# Altium schematic sheet Sch_sheet1.SchDoc
size B; SheetNumber: 1; SheetTotal: 1
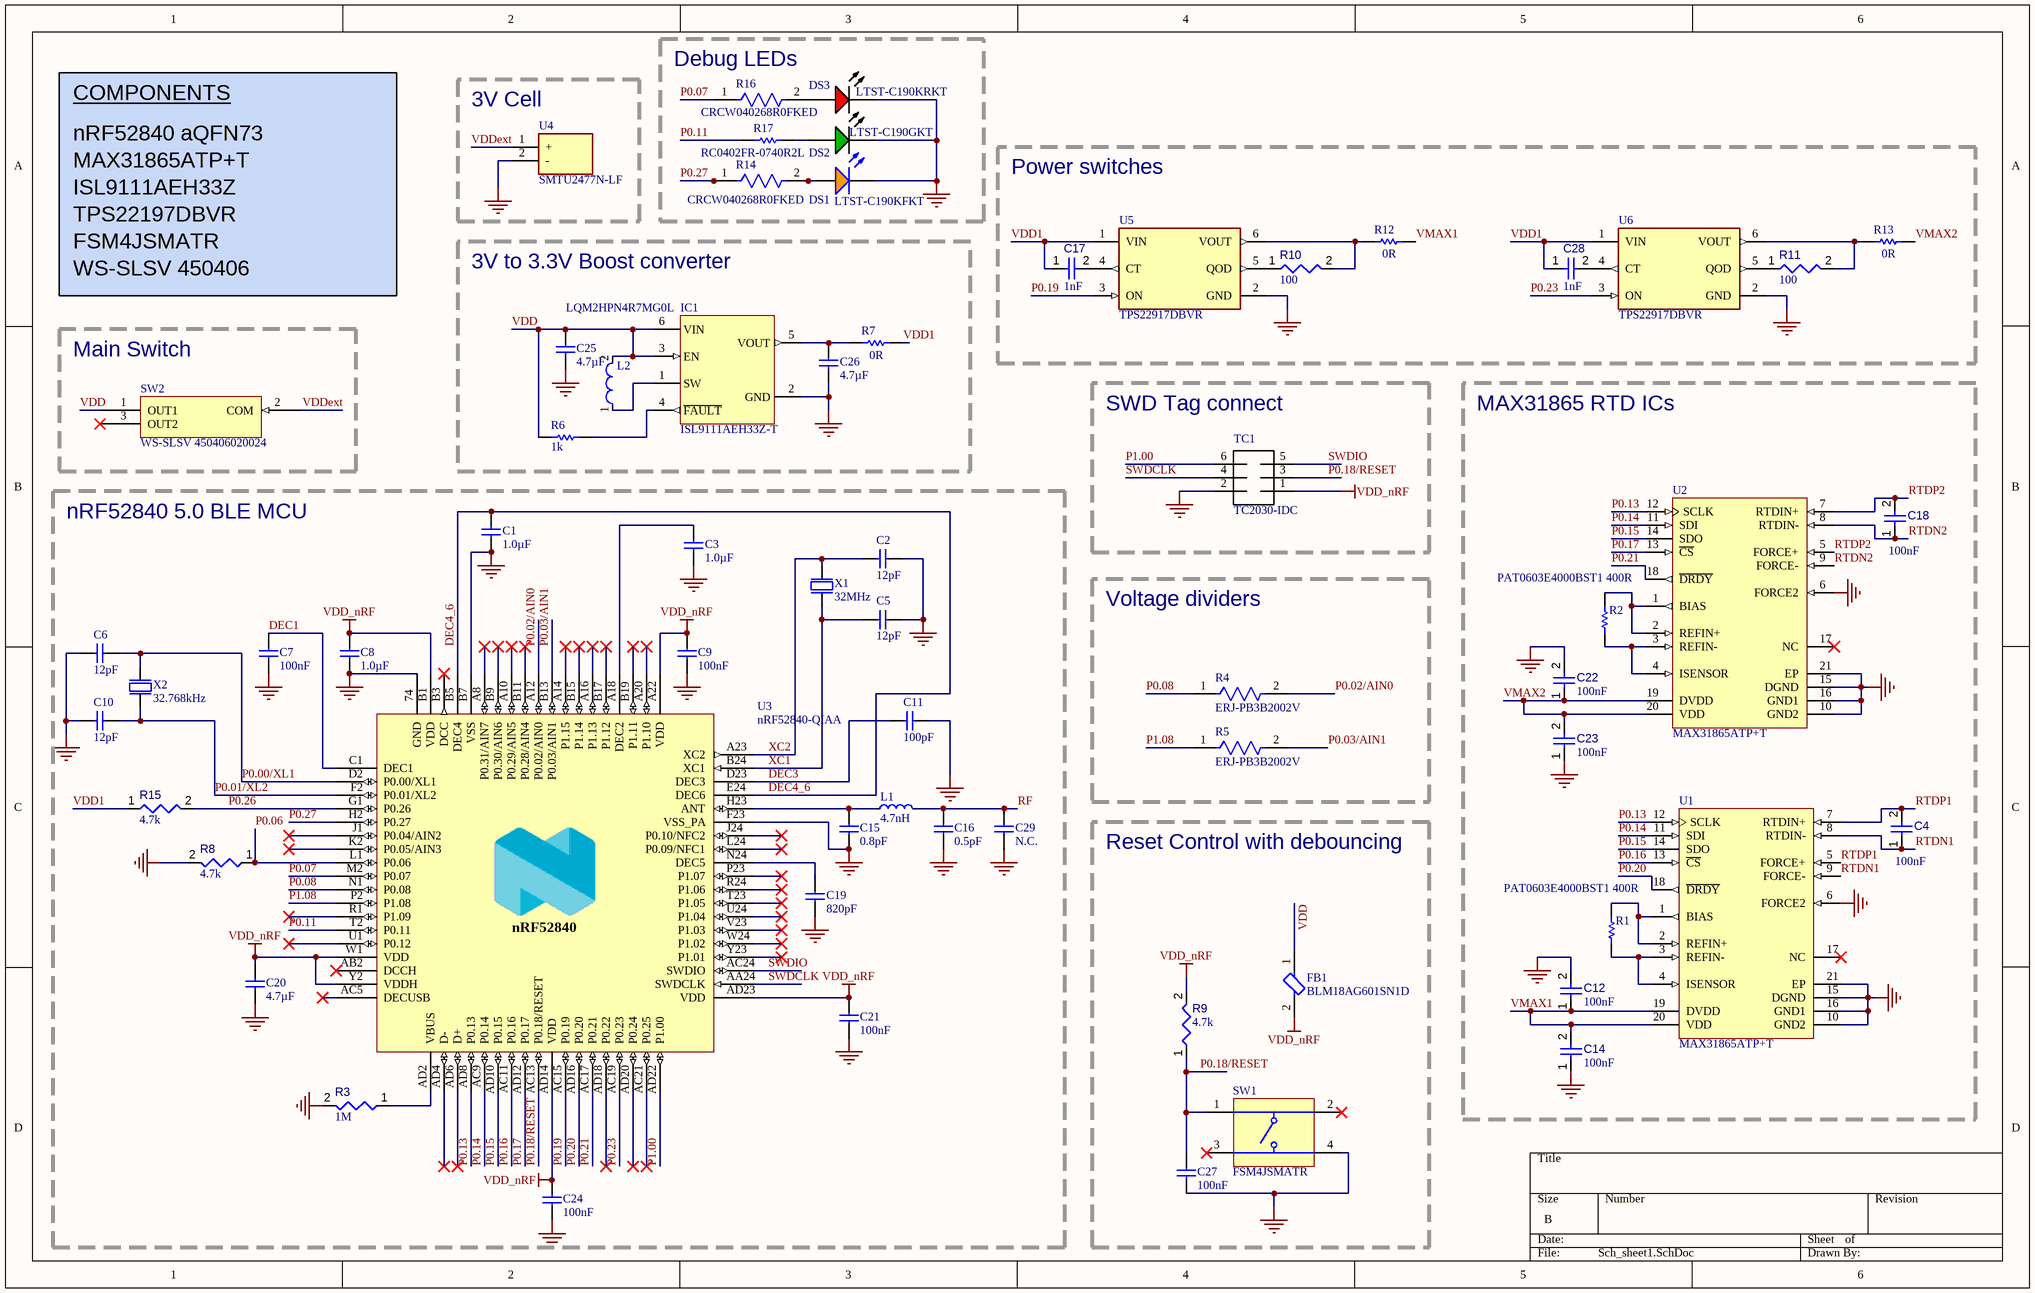
[diagram p0: Sch_sheet1.SchDoc]

## Parts
C1  1.0µF  [CAPC1608X06L]
C2  12pF  [CAPC1005X04L]
C3  1.0µF  [CAPC1608X06L]
C4  value 100nF  [CAPC0402(1005)60_L]  (hidden comment: Capacitor 100nF +/-20% 25V 0402)
C5  12pF  [CAPC1005X04L]
C6  12pF  [CAPC1005X04L]
C7  100nF  [CAPC1005X04L]
C8  1.0µF  [CAPC1608X06L]
C9  100nF  [CAPC1005X04L]
C10  12pF  [CAPC1005X04L]
C11  100pF  [CAPC1005X04L]
C12  value 100nF  [CAPC0402(1005)60_L]  (hidden comment: Capacitor 100nF +/-20% 25V 0402)
C14  value 100nF  [CAPC0402(1005)60_L]  (hidden comment: Capacitor 100nF +/-20% 25V 0402)
C15  0.8pF  [CAPC1005X04L]
C16  0.5pF  [CAPC1005X04L]
C17  value 1nF  [CAPC0402(1005)33_L]  (hidden comment: Capacitor 1nF +/-20% 50V 0402)
C18  value 100nF  [CAPC0402(1005)60_L]  (hidden comment: Capacitor 100nF +/-20% 25V 0402)
C19  820pF  [CAPC1005X04L]
C20  4.7µF  [CAPC1608X06L]
C21  100nF  [CAPC1005X04L]
C22  value 100nF  [CAPC0402(1005)60_L]  (hidden comment: Capacitor 100nF +/-20% 25V 0402)
C23  value 100nF  [CAPC0402(1005)60_L]  (hidden comment: Capacitor 100nF +/-20% 25V 0402)
C24  100nF  [CAPC1005X04L]
C25  4.7µF  [CAPC1608X06L]
C26  4.7µF  [CAPC1608X06L]
C27  100nF  [CAPC1005X04L]
C28  value 1nF  [CAPC0402(1005)33_L]  (hidden comment: Capacitor 1nF +/-20% 50V 0402)
C29  N.C.  [CAPC1005X04L]
DS1  LTST-C190KFKT  [LTST-C190KFKT_V]
DS2  LTST-C190GKT  [LTST-C190GKT_V]
DS3  LTST-C190KRKT  [LTST-C191KRKT_V]
FB1  BLM18AG601SN1D  [FP-BLM18-0_15-t0_8-MFG]
IC1  ISL9111AEH33Z-T  [SOT95P280X145-6N]
L1  4.7nH  [INDC1005X04L]
L2  LQM2HPN4R7MG0L  [FP-LQM2HPN_G0-IPC_A]
R1  PAT0603E4000BST1 400R  [RESC1608X46X38LL15T13]
R2  PAT0603E4000BST1 400R  [RESC1608X46X38LL15T13]
R3  value 1M  [RESC0402(1005)_L]  (hidden comment: Resistor 1M +/-5 % 0402 63 mW)
R4  ERJ-PB3B2002V  [FP-ERJPB3-MFG]
R5  ERJ-PB3B2002V  [FP-ERJPB3-MFG]
R6  value 1k  [RESC3116X70X50ML13T20]  (hidden comment: Resistor 1k +/-1% 1206 250 mW)
R7  0R  [RESC1608X06N]
R8  value 4.7k  [RESC3116X70X50ML13T20]  (hidden comment: Resistor 4k7 +/-1% 1206 250 mW)
R9  value 4.7k  [RESC3116X70X50ML13T20]  (hidden comment: Resistor 4k7 +/-1% 1206 250 mW)
R10  value 100  [RESC0402(1005)_L]  (hidden comment: Resistor 100R +/-1 % 0402 63 mW)
R11  value 100  [RESC0402(1005)_L]  (hidden comment: Resistor 100R +/-1 % 0402 63 mW)
R12  0R  [RESC1608X06N]
R13  0R  [RESC1608X06N]
R14  CRCW040268R0FKED  [FP-CRCW0402-e3-MFG]
R15  value 4.7k  [RESC3116X70X50ML13T20]  (hidden comment: Resistor 4k7 +/-1% 1206 250 mW)
R16  CRCW040268R0FKED  [FP-CRCW0402-e3-MFG]
R17  RC0402FR-0740R2L  [RESC1005X40X25ML05T10]
SW1  FSM4JSMATR  [TECO-FSM4JSMATR_V]
SW2  WS-SLSV 450406020024  [WS-SLSV 450406020024]
TC1  TC2030-IDC  [*TC2030-IDC]
U1  MAX31865ATP+T  [MAXM-T2055+5_L]
U2  MAX31865ATP+T  [MAXM-T2055+5_L]
U3  nRF52840-QIAA  [AQFN50P700X700X85_HS-74N]
U4  SMTU2477N-LF  [SMTU2477NLF]
U5  TPS22917DBVR  [FP-DBV0006A-IPC_A]
U6  TPS22917DBVR  [FP-DBV0006A-IPC_A]
X1  32MHz  [BT-XTAL_2016]
X2  32.768kHz  [XTAL_3215]

## Blocks framed on the sheet
Debug LEDs: DS1-DS3 R14 R16 R17
3V Cell: U4
Power switches: C17 C28 R10-R13 U5 U6
3V to 3.3V Boost converter: C25 C26 IC1 L2 R6 R7
Main Switch: SW2
SWD Tag connect: TC1
MAX31865 RTD ICs: C4 C12 C14 C18 C22 C23 R1 R2 U1 U2
nRF52840 5.0 BLE MCU: C1-C3 C5-C11 C15 C16 C19-C21 C24 C29 L1 R3 R8 R15 U3 X1 X2
Voltage dividers: R4 R5
Reset Control with debouncing: C27 FB1 R9 SW1

## Nets
GND: C1.1 C2.2 C3.1 C5.2 C6.1 C7.1 C8.1 C9.1 C10.1 C11.2 C12.2 C14.1 C15.1 C16.1 C19.1 C20.1 C21.1 C22.2 C23.1 C24.1 C25.1 C26.1 C27.1 C29.1 DS1.2(K) DS2.2(K) DS3.2(K) IC1.2(GND) R3.2 R8.2 SW1.4 TC1.2(GND) U1.6(FORCE2) U1.10(GND2) U1.15(DGND) U1.16(GND1) U1.21(EP) U2.6(FORCE2) U2.10(GND2) U2.15(DGND) U2.16(GND1) U2.21(EP) U3.74(GND) U3.B7(VSS) U3.F23(VSS_PA) U4.2(-) U5.2(GND) U6.2(GND) X1.2(GND) X1.4(GND)
VDD_nRF: C8.2 C9.2 C20.2 C21.2 C24.2 FB1.2 R9.2 TC1.1(VCC) U3.A22(VDD) U3.AD14(VDD) U3.AD23(VDD) U3.B1(VDD) U3.W1(VDD) U3.Y2(VDDH)
DEC1: C7.2 U3.C1(DEC1)
DEC3: C11.1 U3.D23(DEC3)
DEC4_6: C1.2 U3.B5(DEC4) U3.E24(DEC6)
P0.00/XL1: C6.2 U3.D2(P0.00/XL1) X2.2(out)
P0.01/XL2: C10.2 U3.F2(P0.01/XL2) X2.1(inp)
P0.02/AIN0: R4.2 U3.A12(P0.02/AIN0)
P0.03/AIN1: R5.2 U3.B13(P0.03/AIN1)
P0.06: R8.1 U3.L1(P0.06)
P0.07: R16.1 U3.M2(P0.07)
P0.08: R4.1 U3.N1(P0.08)
P0.11: R17.1 U3.T2(P0.11)
P0.13: U1.12(SCLK) U2.12(SCLK) U3.AD8(P0.13)
P0.14: U1.11(SDI) U2.11(SDI) U3.AC9(P0.14)
P0.15: U1.14(SDO) U2.14(SDO) U3.AD10(P0.15)
P0.16: U1.13(~{CS}) U3.AC11(P0.16)
P0.17: U2.13(~{CS}) U3.AD12(P0.17)
P0.18/RESET: C27.2 R9.1 SW1.1 TC1.3(RST) U3.AC13(P0.18/RESET)
P0.19: U3.AC15(P0.19) U5.3(ON)
P0.20: U1.18(~{DRDY}) U3.AD16(P0.20)
P0.21: U2.18(~{DRDY}) U3.AC17(P0.21)
P0.23: U3.AC19(P0.23) U6.3(ON)
P0.26: R15.2 U3.G1(P0.26)
P0.27: R14.1 U3.H2(P0.27)
P1.00: TC1.6(SWO) U3.AD22(P1.00)
P1.08: R5.1 U3.P2(P1.08)
RF: C16.2 C29.2 L1.2
RTDN1: C4.1 U1.8(RTDIN-) U1.9(FORCE-)
RTDN2: C18.1 U2.8(RTDIN-) U2.9(FORCE-)
RTDP1: C4.2 U1.5(FORCE+) U1.7(RTDIN+)
RTDP2: C18.2 U2.5(FORCE+) U2.7(RTDIN+)
SWDCLK: TC1.4(SWCLK) U3.AA24(SWDCLK)
SWDIO: TC1.5(SWDIO) U3.AC24(SWDIO)
VDD: C25.2 FB1.1 IC1.3(EN) IC1.6(VIN) L2.2 R6.1 SW2.1(OUT1)
VDD1: C17.1 C28.1 R7.2 R15.1 U5.1(VIN) U6.1(VIN)
VDDext: SW2.2(COM) U4.1(+)
VMAX1: C12.1 C14.2 R12.2 U1.19(DVDD) U1.20(VDD)
VMAX2: C22.1 C23.2 R13.2 U2.19(DVDD) U2.20(VDD)
XC1: C5.1 U3.B24(XC1) X1.1(inp)
XC2: C2.1 U3.A23(XC2) X1.3(out)
NetC3_2: C3.2 U3.A18(DEC2)
NetC15_2: C15.2 L1.1 U3.H23(ANT)
NetC17_2: C17.2 U5.4(CT)
NetC19_2: C19.2 U3.N24(DEC5)
NetC26_2: C26.2 IC1.5(VOUT) R7.1
NetC28_2: C28.2 U6.4(CT)
NetDS1_1: DS1.1(A) R14.2
NetDS2_1: DS2.1(A) R17.2
NetDS3_1: DS3.1(A) R16.2
NetIC1_1: IC1.1(SW) L2.1
NetIC1_4: IC1.4(~{FAULT}) R6.2
NetR1_1: R1.1 U1.1(BIAS) U1.2(REFIN+)
NetR1_2: R1.2 U1.3(REFIN-) U1.4(ISENSOR)
NetR2_1: R2.1 U2.1(BIAS) U2.2(REFIN+)
NetR2_2: R2.2 U2.3(REFIN-) U2.4(ISENSOR)
NetR3_1: R3.1 U3.AD2(VBUS)
NetR10_1: R10.1 U5.5(QOD)
NetR10_2: R10.2 R12.1 U5.6(VOUT)
NetR11_1: R11.1 U6.5(QOD)
NetR11_2: R11.2 R13.1 U6.6(VOUT)

Not connected (* = marked no-connect by the designer): SW1 2* 3*; SW2 3(OUT2)*; U1 17(NC)*; U2 17(NC)*; U3 A8(P0.31/AIN7)* A10(P0.29/AIN5)* A14(P1.15)* A16(P1.13)* A20(P1.10)* AB2(DCCH)* AC5(DECUSB)* AC21(P0.25)* AD4(D-)* AD6(D+)* AD18(P0.22)* AD20(P0.24)* B3(DCC)* B9(P0.30/AIN6)* B11(P0.28/AIN4)* B15(P1.14)* B17(P1.12)* B19(P1.11)* J1(P0.04/AIN2)* J24(P0.10/NFC2)* K2(P0.05/AIN3)* L24(P0.09/NFC1)* P23(P1.07)* R1(P1.09)* R24(P1.06)* T23(P1.05)* U1(P0.12)* U24(P1.04)* V23(P1.03)* W24(P1.02)* Y23(P1.01)*

## Notes on the sheet
- COMPONENTS
- nRF52840 aQFN73
- MAX31865ATP+T
- ISL9111AEH33Z
- TPS22197DBVR
- FSM4JSMATR
- WS-SLSV 450406
- (in symbol nRF52840-QIAA) nRF52840

## Library data of the parts
C1 C3 C8 = C0603-1µ0: Capacitor, X7R, ±10%; Pad Count: 2; Part Number: C0603-1µ0; LatestRevisionDate: 2013-06-05; Published: 2009-05-08; Value: 1.0µF; Footprint Doc: 0603
C2 C5 C6 C10 = C0402-12p: Capacitor, NP0, ±2%; Pad Count: 2; Part Number: C0402-12p; LatestRevisionDate: 2011-05-11; Published: 2009-05-08; Value: 12pF; Footprint Doc: 0402
C4 C12 C14 C18 C22 C23 = CMP-001-00065-4: Chip Capacitor, 100nF +/-20%, 25V, 0402, Thickness 0.6 mm; Tolerance: 10%; Max Operating Temperature: 85°C; Min Operating Temperature: -55°C; Pins: 2; Voltage Rating: 25V; Mounting Technology: SMT; Case/Package: 0402
C7 C9 C21 C24 C27 = C0402-100n: Capacitor, X7R, ±10%; Pad Count: 2; Part Number: C0402-100n; LatestRevisionDate: 2009-11-23; Published: 2009-05-08; Value: 100nF; Footprint Doc: 0402
C11 = C0402-100p: Capacitor, NP0, ±5%; Pad Count: 2; Part Number: C0402-100p; LatestRevisionDate: 2009-05-08; Published: 2009-05-08; Value: 100pF; Footprint Doc: 0402
C15 = C0402-0.8p: Capacitor, NP0, ±10%; Pad Count: 2; Part Number: C0402-0.8p; LatestRevisionDate: 2012-11-21; Published: 2009-05-08; Value: 0.8pF; Footprint Doc: 0402
C16 = C0402-0.5p: Capacitor, NP0, ±10%; Pad Count: 2; Part Number: C0402-0.5p; LatestRevisionDate: 2017-02-23; Published: 2009-05-08; Value: 0.5pF; Footprint Doc: 0402
C17 C28 = CMP-001-00066-3: Chip Capacitor, 1nF +/-20%, 50V, 0402, Thickness 0.33 mm; Tolerance: 10%; Case/Package: 0402; Pins: 2; Min Operating Temperature: -55°C; Max Operating Temperature: 85°C; Voltage Rating: 50V; Mounting Technology: SMT
C19 = C0402-820p: Capacitor, NP0, ±5%; Pad Count: 2; Part Number: C0402-820p; LatestRevisionDate: 2009-05-08; Published: 2009-05-08; Value: 820pF; Footprint Doc: 0402
C20 C25 C26 = C0603-4µ7-6.3V-X7R: Capacitor, X7R, ±10%; Pad Count: 2; Part Number: C0603-4µ7-6.3V-X7R; LatestRevisionDate: 2015-06-10; Published: 2015-06-10; Value: 4.7µF; Footprint Doc: 0603
C29 = C0402-N.C.: Not mounted; Pad Count: 2; Assembly: Not mounted; Part Number: C0402-N.C.; LatestRevisionDate: 2009-05-08; Published: 2009-05-08; Value: N.C.; Footprint Doc: 0402
DS1 = CMP-007-00023-2: LED Uni-Color Orange, 75 mW, 30 mA, -35 to 85 degC, 2-Pin SMD, RoHS, Tape and Reel; Manufacturer: Lite-On; Power: 75mW; Luminous Intensity: 90mcd; Nominal Vf: 2V; Lens Style: Diffused; Forward Current: 20mA; Viewing Angle: 130degrees; Max Operating Temperature: 85°C; Manufacturer URL: http://www.us.liteon.com/; Package Description: 2-Pin Surface Mount Device, Body 1.6 x 0.8 mm; Package Quantity: 3000; Pins: 2; Min Operating Temperature: -55°C; Mounting Technology: SM; Colour: Orange; Packaging: TapeandReel; Case/Package: 0603; Datasheet Version: Rev. I, 09/2011; Illumination Colour: Orange; Datasheet URL: http://optoelectronics.liteon.com/upload/download/DS-22-99-0186/S_110_LTST-C190KFKT.pdf; Package Reference: C190KFKT; RoHS Compliant: True; Forward Voltage: 2V
DS2 = CMP-007-00022-2: LED Uni-Color Green, 100 mW, 30 mA, -55 to 85 degC, 2-Pin SMD, RoHS, Tape and Reel; Manufacturer: Lite-On; Power: 100mW; Forward Voltage: 2.1V; Viewing Angle: 130degrees; Forward Current: 20mA; Luminous Intensity: 6mcd; Lens Style: Clear; Manufacturer URL: http://www.us.liteon.com/; RoHS Compliant: True; Colour: Green; Package Description: 2-Pin Surface Mount Device, Body 1.6 x 0.8 mm; Datasheet URL: http://datasheet.octopart.com/LTST-C190GKT-Lite-On-datasheet-158530.pdf; Datasheet Version: Dec-06; Mounting Technology: SM; Case/Package: 0603; Package Reference: C190GKT; Packaging: TapeandReel; Min Operating Temperature: -55°C; Nominal Vf: 2.1V; Package Quantity: 3000; Illumination Colour: Green; Max Operating Temperature: 85°C; Pins: 2
DS3 = CMP-007-00024-2: LED Uni-Color Red, 62.5 mW, 25 mA, -30 to 85 degC, 2-Pin SMD, RoHS, Tape and Reel; Manufacturer: Lite-On; Power: 75mW; Forward Voltage: 2V; Luminous Intensity: 54mcd; Lens Style: Diffused; Viewing Angle: 130degrees; Forward Current: 20mA; Manufacturer URL: http://www.us.liteon.com/; Case/Package: 0603; Datasheet Version: Rev. F, 05/2013; Package Reference: C191KRKT; Datasheet URL: http://optoelectronics.liteon.com/upload/download/DS-22-99-0151/S_110_LTST-C190KRKT.pdf; Package Description: 2-Pin Surface Mount Device, Body 1.6 x 0.8 mm; Nominal Vf: 2V; Packaging: TapeandReel; RoHS Compliant: True; Pins: 2; Illumination Colour: Red; Colour: Red; Mounting Technology: SM; Package Quantity: 3000; Min Operating Temperature: -55°C; Max Operating Temperature: 85°C
FB1 = CMP-0686-00436-3: Chip Ferrite Bead, 0603, 600Ω @ 100MHz, 0.38Ω, 25%, 500mA; Number of Lines: 1; Impedance: 600R; DC Resistance (DCR): 380mR; Material: Steel; Shielding: Unshielded; Max DC Current: 500mA; Termination: SMD/SMT; Military Standard: Not; Number of Circuits: 1; Min Operating Temperature: -55°C; Case Code (Imperial): 0603; Width: 0.8mm; Current Rating: 500mA; Lead Free: Lead Free; Packaging: Tape and Reel; Frequency: 100MHz; Max Operating Temperature: 125°C; DC Current: 500mA; REACH SVHC: No SVHC; Case/Package: 0603; Package Quantity: 1; Height: 0.8mm; Number of Pins: 2; Depth: 0.8mm; Test Frequency: 100MHz; Case Code (Metric): 1608; Tolerance: 25%; Core Material: Ferrite; Weight: 7.1E-05oz; Max Current Rating: 500mA; Radiation Hardening: No; Length: 1.6mm; RoHS Compliant: Yes
IC1 = CMP-00572-88256068-1: ISL9111AEH33Z-T Low Input Voltage, High Efficiency Synchronous Boost Converter with 1A Switch; NexarPartId: 88256068
L1 = L0402-4n7: High frequency chip inductor ±5%; Pad Count: 2; Part Number: L0402-4n7; LatestRevisionDate: 2012-09-19; Published: 2009-05-08; Value: 4.7nH; Footprint Doc: 0402
L2 = CMP-06042-016771-1: Multilayer Type Inductor for Power Lines, 1008 (2520), 4.7μH, 20%, 0.138Ω, 1.1A; Shielding: Shielded; DC Resistance (DCR): 110mR; Core Material: Ferrite; Test Frequency: 1MHz; Inductance: 4.7uH; Self Resonant Frequency: 25MHz; Max DC Current: 1.1A; REACH SVHC: No SVHC; Series: LQM2HP_G0; Case Code (Metric): 2520; Current Rating: 1.1A; Packaging: Tape and Reel; Tolerance: 20%; Military Standard: Not; Min Operating Temperature: -55°C; RoHS Compliant: Yes; Width: 0.079inch; Depth: 2.2mm; Max Operating Temperature: 125°C; Package Quantity: 3000; Mount: Surface Mount; Termination: SMD/SMT; Height: 1.2mm; Case/Package: 1008; Rated Current-Max: 1.1A; Height - Seated (Max): 0.039inch; Case Code (Imperial): 1008; Radiation Hardening: No; Lead Free: Lead Free; DC Current: 1.1A; Length: 2.5mm; Inductance Tolerance: 20%
R1 R2 = CMP-2000-06875-1: Chip Resistor, 400 Ohm, +/- 0.1%, 0.15 W, -55 to 155 degC, 0603 (1608 Metric), RoHS, Tape and Reel; Manufacturer: Vishay; Voltage Rating: 75V; Brand: Vishay/ThinFilm; Resistance: 400Ohms; Power Rating: 150mW; Temperature Coefficient: 25PPM/C; Length: 1.524mm; Case Code - in: 0603; Operating Temperature Range: -55Cto+125C; Package Reference: 0603; Datasheet Version: 09/2015; RoHS: Details; Width: 0.762mm; Product Category: ThinFilmResistors-SMD; Mounting Technology: SurfaceMount; Termination Style: SMD/SMT; Manufacturer URL: http://www.vishay.com/; Packaging: Reel; Tolerance: 0.1%; Height: 0.254mm; Datasheet URL: http://www.vishay.com/docs/60024/pat.pdf; Package / Case: 0603(1608metric); Package Description: 2-Pin Surface Mount Device, Body 1.63 x 0.813 mm; Case Code - mm: 1608; Factory Pack Quantity: 1000; Type: PrecisionAutomotiveThinFilmChipResistors; Product: PrecisionAutomotiveThinFilmSMD; Series: PAT
R3 = CMP-009-00151-3: Chip Resistor, 1 MOhms, +/-5 %, 63 mW, -55 to 155 degC, 0402; Power: 63mW; Tolerance: 5%; Pins: 2; Min Operating Temperature: -55°C; Case/Package: 0402; Max Operating Temperature: 155°C
R4 R5 = CMP-00287-75583136-1: ERJ-PB3B2002V Res Thick Film 0603 20K Ohm 0.1% 0.2W(1/5W) ±50ppm/°C Pad SMD Automotive T/R; Voltage Rating (DC): 150V; Resistance: 20kΩ; Power Rating: 200mW; RoHS: Compliant; Features: Automotive AEC-Q200; Case Code (Metric): 1608; Case/Package: 0603; Composition: Thick Film; Number of Terminations: 2; Min Operating Temperature: -55°C; Case Code (Imperial): 0603; Temperature Coefficient: 50ppm/°C; Width: 812.8µm; Max Power Dissipation: 200mW; NexarPartId: 75583136; Height - Seated (Max): 558.8µm; Length: 1.6002mm; Tolerance: 0.1%; Schedule B: 8533210045; Max Operating Temperature: 155°C
R6 = CMP-009-00011-5: Chip Resistor, 1 KOhm, +/- 1%, 0.25 W, -55 to 155 degC, 1206 (3216 Metric); Voltage Rating: 200V; Power: 250mW; Max Operating Temperature: 155°C; Mounting Technology: SM; Tolerance: 1%; Case/Package: 1206; RoHS Compliant: True; Min Operating Temperature: -55°C; Pins: 2
R7 R12 R13 = RP-0-SR-KOA: Resistor, 0 ohms, 1/8W, 1%, SM; Manufacturer's Part #: RK73Z1JTTD; Manufacturer: KOA Speer; Detailed Description: Resistor, 0 ohms, 1/8W, 1%, 100 ppm, SM, 75 WV, 100 OV, Thick Film, 0603, RoHS; Voltage Rating: 75V; Resistance: 0; Part: 0R; Type: Resistor; Revision: 1; Power Rating: 1/8W; Tolerance: 1%; Package: 0603; Supplier 1: Arrow Electronics; Supplier 2: Digi-Key; Supplier 3: Mouser; Supplier Part Number 1: RK73Z1JTTD; Supplier Part Number 2: 2019-RK73Z1JTTDCT-ND; Supplier Part Number 3: 660-RK73Z1JTTD
R8 R9 R15 = CMP-009-00033-5: Chip Resistor, 4.7 KOhm, +/- 1%, 0.25 W, -55 to 155 degC, 1206 (3216 Metric); Power: 250mW; Voltage Rating: 200V; Pins: 2; Min Operating Temperature: -55°C; Max Operating Temperature: 155°C; Case/Package: 1206; Tolerance: 1%; RoHS Compliant: True; Mounting Technology: SM
R10 R11 = CMP-009-00167-3: Chip Resistor, 100 Ohms, +/-1 %, 63 mW, -55 to 155 degC, 0402; Power: 63mW; Tolerance: 1%; Min Operating Temperature: -55°C; Case/Package: 0402; Pins: 2; Max Operating Temperature: 155°C
R14 R16 = CMP-1011-00378-3: RES Thick Film, 68Ω, 1%, 0.063W, 100ppm/°C, 0402; Voltage Rating: 50V; Resistance: 68R; Power Rating: 63mW; Radiation Hardening: No; Packaging: Tape and Reel; Termination: SMD/SMT; Lead Free: Lead Free; Case/Package: 0402; Contact Plating: Tin; Composition: Thick Film; Mount: Surface Mount; Military Standard: Not; Weight: 2.3E-05oz; Package Quantity: 10000; Depth: 0.5mm; Height: 0.35mm; Case Code (Imperial): 0402; Temperature Coefficient: 100ppm/°C; Min Operating Temperature: -55°C; Width: 0.5mm; Length: 1mm; Voltage Rating (DC): 50V; Case Code (Metric): 1005; Tolerance: 1%; Max Operating Temperature: 155°C
R17 = CMP-2002-07677-1: Manufacturer: Yageo; Part Number: RC0402FR-0740R2L
SW1 = CMP-2000-07486-1: Micro Miniature Push Button Switch FSM JSM, 50 mA, -35 to 85 degC, 4-Pin SMD, RoHS, Tape and Reel; Manufacturer: TE Connectivity; Mechanical Life: 100000Cycles; Current Rating: 50mA; Actuator Material: Polyamide; Max Voltage Rating (DC): 12V; Capacitance: 0f; Illumination Type: Illuminated; Voltage Rating (DC): 24V; Case\/Package: SMD/SMT; Operating Force: 160gf; Contact Resistance: 100mOhm; Actuator Length: 0.055inch; Switch Travel: 0.25mm; Throw Configuration: SPST; Termination: GullWing; Contact Plating: Silver; Orientation: Straight; Mounting Technology: SurfaceMount; REACH SVHC: Unknown; Electrical Life: 100000Cycles; Package Reference: FSM4JSMATR; Max Operating Temperature: 85degC; Manufacturer URL: http://www.te.com/; Package Description: 4-Pin Surface Mount Device, Body 6 x 6 mm, Pitch 4.5 mm; Datasheet Version: Rev. V, 02/2015; Packaging: TapeandReel; Min Operating Temperature: -35degC; Mount: SurfaceMount; Contact Current Rating: 50mA; Contact Material: CopperAlloy; Package Quantity: 1200; Datasheet URL: http://www.te.com/commerce/DocumentDelivery/DDEController?Action=showdoc&DocId=Customer+Drawing%7F2-1437565-7%7FV%7Fpdf%7FEnglish%7FENG_CD_2-1437565-7_V.pdf%7F4-1437565-2; RoHSCompliant: true
SW2 = CMP-011-00013-1: Slide Switches WS-SLSV 9.0 x 3.5 mm SPDT ON-ON Pitch 2.5 mm Vertical type SMT; Current Rating: 300mA; Pins: 3; ComponentLink1Description: https://www.we-online.com/components/products/datasheet/450406020024.pdf
TC1 = TC2030-IDC: PLUG-OF-NAILS 6-PIN W/ LEGS 8; MF: Tag-Connect LLC; SnapEDA_Link: https://www.snapeda.com/parts/TC2030-IDC/Tag-Connect/view-part/?ref=snap; Package: None; MP: TC2030-IDC; Check_prices: https://www.snapeda.com/parts/TC2030-IDC/Tag-Connect/view-part/?ref=eda; Value: *
U1 U2 = CMP-0253-00508-1: RTD-to-Digital Converter, 15 Bits Temperature Resolution, -40 to 125 degC, 20-Pin QFN (T2055+5), Pb-Free, Tape and Reel; Interface: SPI; Parasite Pwr.: No; ComponentLink2URL: http://datasheets.maximintegrated.com/en/ds/MAX31865.pdf; ComponentLink2Description: Datasheet; PackageReference: T2055+5; ComponentLink3URL: http://pdfserv.maximintegrated.com/package_dwgs/21-0140.PDF; ComponentLink1Description: Manufacturer URL; Packing: Tape and Reel; PartNumber: MAX31865ATP+T; Mounting Technology: Surface Mount; Functions: RTD-to-Digital Converter; Code_JEDEC: MO-220; DatasheetVersion: Rev. 0; PackageVersion: Rev. Q, 09/2011; PackageDescription: 20-Pin Thin Quad Flatpack, No Leads, Body 5 x 5 mm, Pitch 0.65 mm; ComponentLink1URL: http://www.maximintegrated.com/; Generic Part Number: MAX31865; ComponentLink3Description: Package Specification
U3 = nRF52840-QIAA: Multi-protocol Bluetooth Low Energy, IEEE 802.15.4, ANT and 2.4GHz proprietary system-on-chip; Pad Count: 73; Part Number: nRF52840-QIAA; LatestRevisionDate: 2017-08-21; Published: 2017-08-21; Value: nRF52840-QIAA; Footprint Doc: AQFN-73
U4 = SMTU2477N-LF: Undefined or Miscellaneous; Manufacturer_Name: RENATA; Datasheet Link: https://www.renata.com/fileadmin/downloads/designersguide/DesignersGuide-2011_Battery_Holders.pdf; Height: 10.3mm; Manufacturer_Part_Number: SMTU2477N-LF; Mouser Part Number: 614-SMTU2477N-LF; Mouser Price/Stock: https://www.mouser.co.uk/ProductDetail/Renata/SMTU2477N-LF?qs=IDvgEwHcw2zR85QFBHSfyw%3D%3D
U5 U6 = CMP-04912-000029-1: IC PWR SWITCH P-CHAN 1:1 SOT23-6; Number of Outputs: 1; Output Configuration: High Side; Fault Protection: Reverse Current; Interface: On/Off; Max Output Current: 2A; Max Operating Temperature: 125°C; Case/Package: SOT-23-6; Packaging: Tape and Reel; Number of Channels: 1; Min Operating Temperature: -40°C
X1 = XTAL_SMD2016_32MHz_8pF_General: XTAL SMD 2016, 32MHz, Cl=8pF, Total Tol: ±40ppm; Pad Count: 4; Part Number: XTAL_SMD2016_32MHz_8pF_General; LatestRevisionDate: 2016-08-19; Published: 2016-08-19; Value: 32MHz; Footprint Doc: XTAL_2016
X2 = XTAL_SMD3215_32.768kHz_9pF_General: XTAL SMD 3215, 32.768kHz, Cl=9pF, Total Tol: ±50ppm; Pad Count: 2; Part Number: XTAL_SMD3215_32.768kHz_9pF_General; LatestRevisionDate: 2016-08-19; Published: 2016-08-19; Value: 32.768kHz; Footprint Doc: XTAL_3215